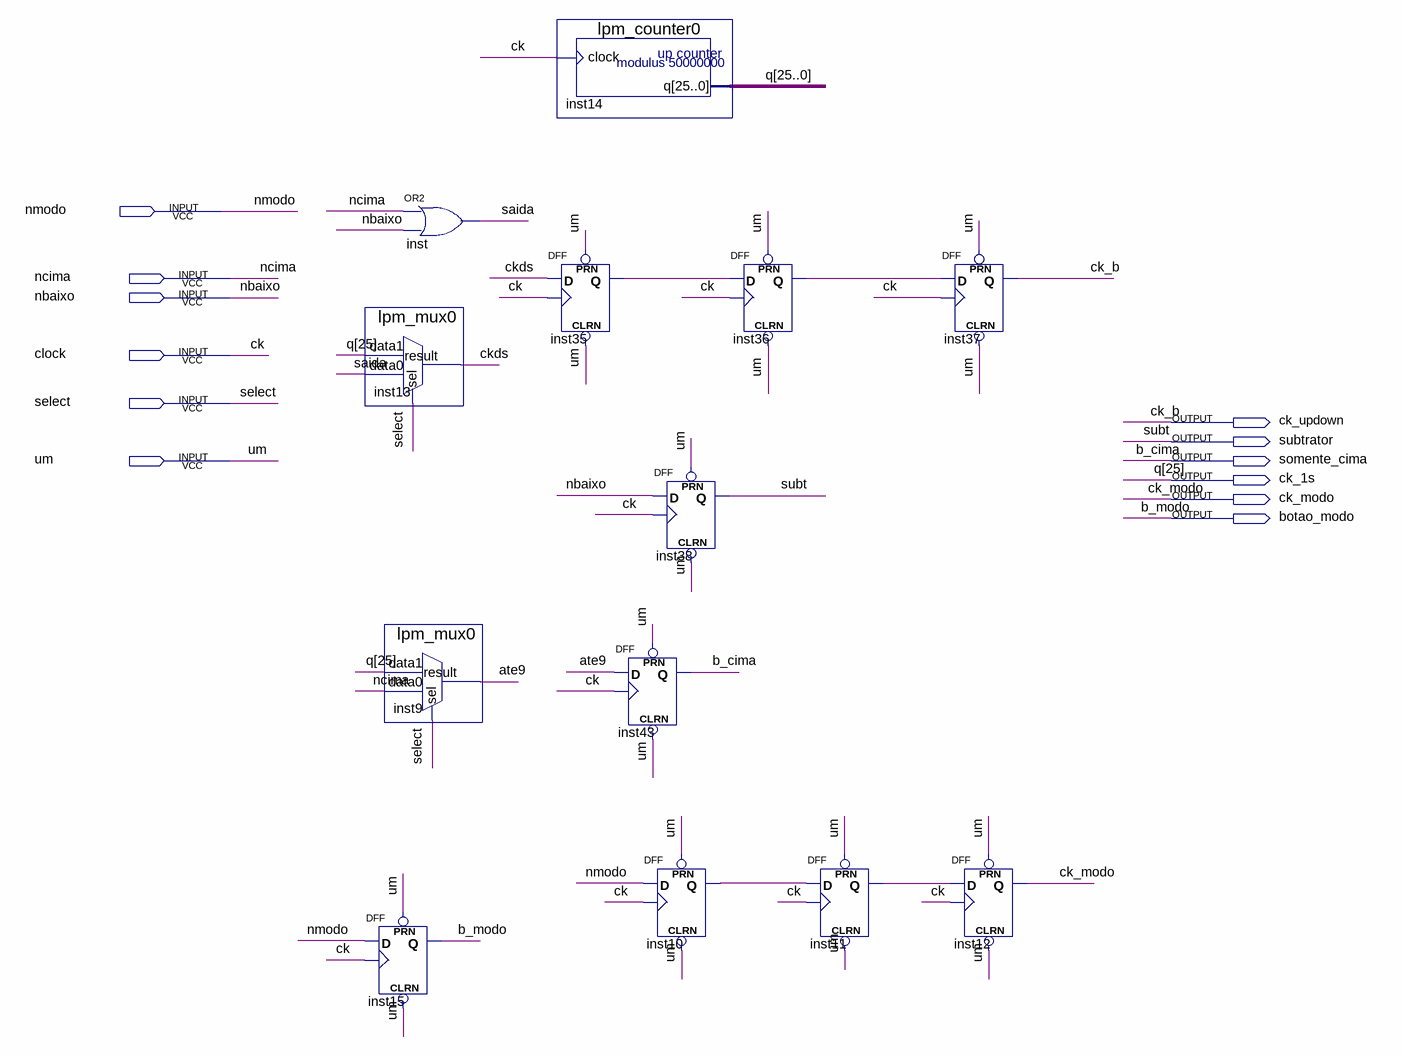
[diagram p0: schematic sheet]
// Quartus schematic delay.bdf as structural Verilog: 13 symbols, 12 pins
module delay (
  input  nmodo,
  input  ncima,
  input  nbaixo,
  input  clock,
  input  select,
  input  um,
  output ck_updown,
  output subtrator,
  output somente_cima,
  output ck_1s,
  output ck_modo,
  output botao_modo
);

  wire ate9, ckds, inst10_q, inst11_q, inst35_q, inst36_q, saida;
  wire [24:0] q;

  or inst (saida, ncima, nbaixo);
  lpm_mux0 inst13 (.data1(ck_1s), .data0(saida), .sel(select), .result(ckds));
  lpm_mux0 inst9 (.data1(ck_1s), .data0(ncima), .sel(select), .result(ate9));
  DFF inst15 (.CLRN(um), .CLK(clock), .D(nmodo), .PRN(um), .Q(botao_modo));
  lpm_counter0 inst14 (.clock(clock), .q({ck_1s, q}));
  DFF inst35 (.CLRN(um), .CLK(clock), .D(ckds), .PRN(um), .Q(inst35_q));
  DFF inst38 (.CLRN(um), .CLK(clock), .D(nbaixo), .PRN(um), .Q(subtrator));
  DFF inst43 (.CLRN(um), .CLK(clock), .D(ate9), .PRN(um), .Q(somente_cima));
  DFF inst10 (.CLRN(um), .CLK(clock), .D(nmodo), .PRN(um), .Q(inst10_q));
  DFF inst36 (.CLRN(um), .CLK(clock), .D(inst35_q), .PRN(um), .Q(inst36_q));
  DFF inst11 (.CLRN(um), .CLK(clock), .D(inst10_q), .PRN(um), .Q(inst11_q));
  DFF inst37 (.CLRN(um), .CLK(clock), .D(inst36_q), .PRN(um), .Q(ck_updown));
  DFF inst12 (.CLRN(um), .CLK(clock), .D(inst11_q), .PRN(um), .Q(ck_modo));

  // Other names for the same wires on the sheet: b_cima = somente_cima; b_modo = botao_modo; ck = clock;
  //   ck_b = ck_updown; q[25] = ck_1s; subt = subtrator
endmodule
